# Altium project main_board.PrjPcb
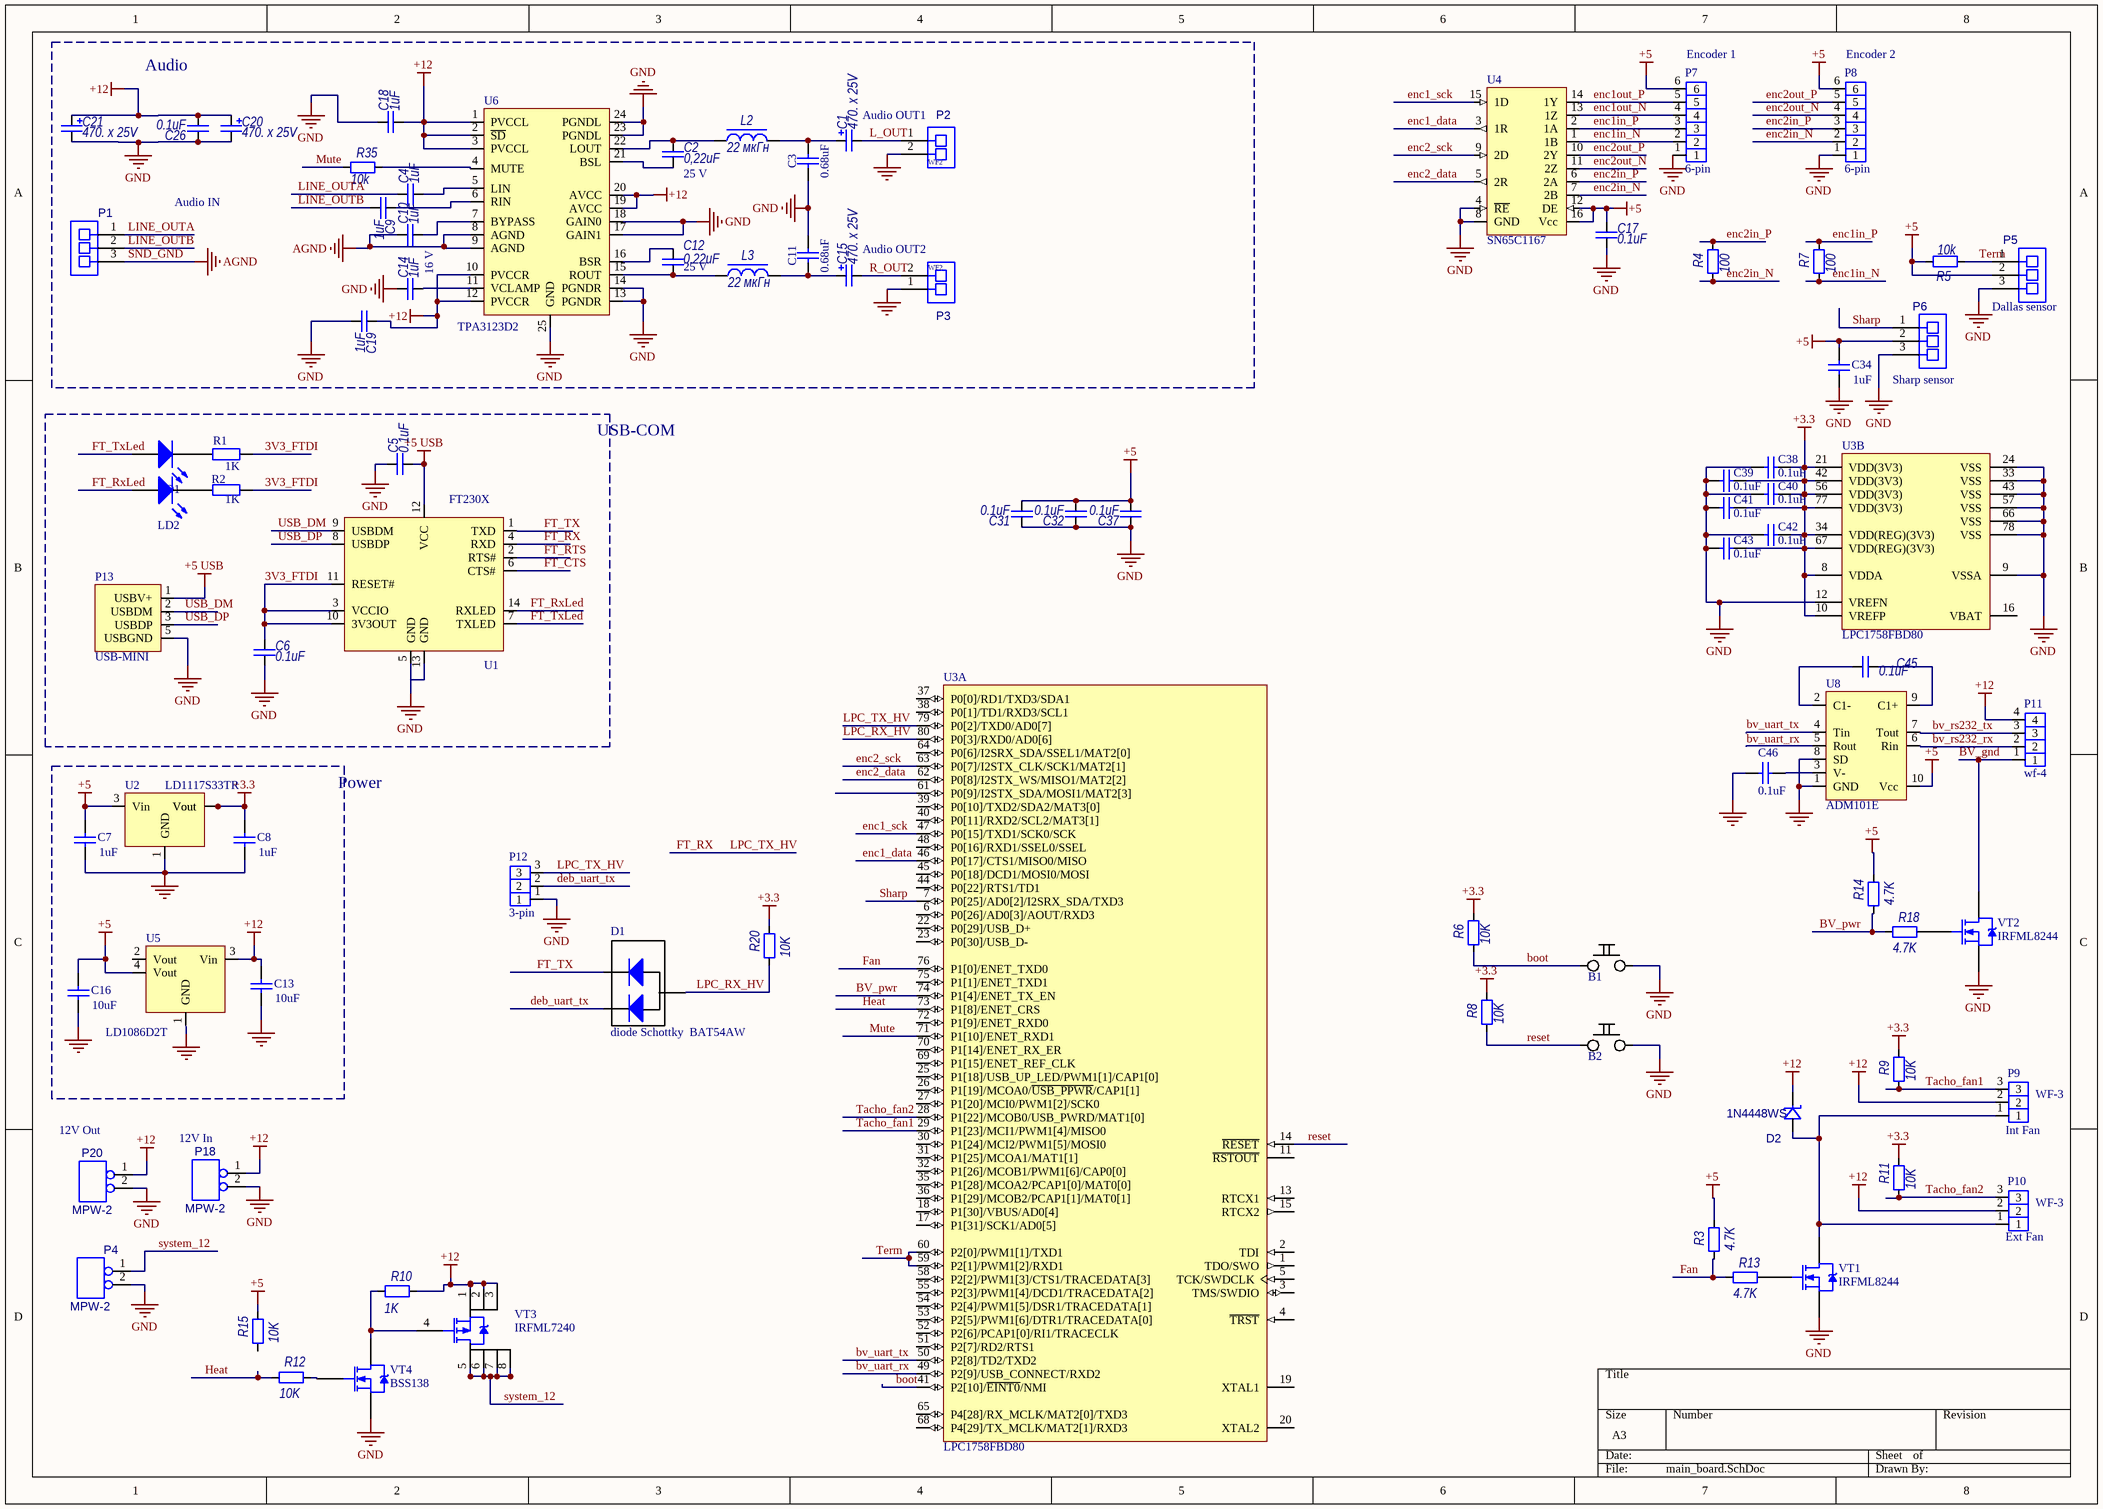
[diagram p0: main_board.SchDoc]
1 sheet, 86 parts. Net scope: global (net labels, ports and power ports of the same name join across sheets).
Board file: main_board.PcbDoc

## Sheet main_board.SchDoc
size A3

### Parts
B1  smd button  [BUTTON SMD]  (value not drawn)
B2  smd button  [BUTTON SMD]  (value not drawn)
C1  470. x 25V  [CAP+_D10_dip]
C2  0,22uF  voltage: 25 V  [CAPC1608M]
C3  0.68uF  [CAPC3216N]
C4  1uF  [CAPC1608M]
C5  0.1uF  [CAPC1608M]
C6  0.1uF  [CAPC1608M]
C7  1uF  [CAPC1608M]
C8  1uF  [CAPC1608M]
C9  1uF  [CAPC1608M]
C10  1uF  [CAPC1608M]
C11  0.68uF  [CAPC3216N]
C12  0,22uF  voltage: 25 V  [CAPC1608M]
C13  10uF  [CAPC1608M]
C14  1uF  voltage: 16 V  [CAPC1608M]
C15  470. x 25V  [CAP+_D10_dip]
C16  10uF  [CAPC1608M]
C17  0.1uF  [CAPC1608M]
C18  1uF  [CAPC1608M]
C19  1uF  [CAPC1608M]
C20  470. x 25V  [CAP+_D10_dip]
C21  470. x 25V  [CAP+_D10_dip]
C26  0.1uF  [CAPC1608M]
C31  0.1uF  [CAPC1608M]
C32  0.1uF  [CAPC1608M]
C34  1uF  [CAPC1608M]
C37  0.1uF  [CAPC1608M]
C38  0.1uF  [CAPC1608M]
C39  0.1uF  [CAPC1608M]
C40  0.1uF  [CAPC1608M]
C41  0.1uF  [CAPC1608M]
C42  0.1uF  [CAPC1608M]
C43  0.1uF  [CAPC1608M]
C45  0.1uF  [CAPC1608M]
C46  0.1uF  [CAPC1608M]
D1  diode Schottky  BAT54AW  [SOT323-3AM]
D2  1N4448WS  [CD2012-0805]
L2  22 мкГн  [SDR0805]
L3  22 мкГн  [SDR0805]
LD1  green led  [RESC2012M]  (value not drawn)
LD2  red led  [RESC2012M]  (value not drawn)
P1  WF-3  [WF-3]  (value not drawn)
P2  WF2  [wf-2]
P3  WF2  [wf-2]
P4  MPW-2  [MPW-2]
P5  WF-3  [WF-3]  (value not drawn)
P6  WF-3  [WF-3]  (value not drawn)
P7  6-pin  [wf-6]
P8  6-pin  [wf-6]
P9  WF-3  [wf-3]
P10  WF-3  [wf-3]
P11  wf-4  [wf-4]
P12  3-pin  [conn_3_2.54]
P13  USB-MINI  [USB/SM0.8-6H5 - step]
P18  MPW-2  [MPW-2]
P20  MPW-2  [MPW-2]
R1  1K  [RESC1608M]
R2  1K  [RESC1608M]
R3  4.7K  [RESC1608M]
R4  100  [RESC1608M]
R5  10k  [RESC1608M]
R6  10K  [RESC1608M]
R7  100  [RESC1608M]
R8  10K  [RESC1608M]
R9  10K  [RESC1608M]
R10  1K  [RESC1608M]
R11  10K  [RESC1608M]
R12  10K  [RESC1608M]
R13  4.7K  [RESC1608M]
R14  4.7K  [RESC1608M]
R15  10K  [RESC1608M]
R18  4.7K  [RESC1608M]
R20  10K  [RESC1608M]
R35  10k  [RESC1608M]
U1  FT230X  [SOP635P600-16N]
U2  LD1117S33TR  [SOT223-4M_2-4SC]
U3  LPC1758FBD80  [SOT315-1_V]  (parts A,B of 2)
U4  SN65C1167  [SOIC127P600-16M - increase width]
U5  LD1086D2T  [TO254P1280-3_4M]
U6  TPA3123D2
U8  ADM101E  [TSSOP50P490-10AM]
VT1  IRFML8244
VT2  IRFML8244
VT3  IRFML7240
VT4  BSS138

### Blocks framed on the sheet
Audio: C1-C4 C9-C12 C14 C15 C18-C21 C26 L2 L3 P1-P3 R35 U6
USB-COM: C5 C6 LD1 LD2 P13 R1 R2 U1
Power: C7 C8 C13 C16 U2 U5

### Nets
+3.3: C8.1 C38.2 C39.2 C40.2 C41.2 C42.2 C43.2 R6.2 R8.2 R9.2 R11.2 R20.2 U2.2(Vout) U2.4(Vout) U3.8(VDDA) U3.10(VREFP) U3.21(VDD(3V3)) U3.34(VDD(REG)(3V3)) U3.42(VDD(3V3)) U3.56(VDD(3V3)) U3.67(VDD(REG)(3V3)) U3.77(VDD(3V3))
+5: C7.1 C16.1 C17.1 C31.2 C32.2 C34.1 C37.2 P5.2 P6.2 P7.6 P8.6 R3.2 R5.2 R14.2 R15.2 U2.3(Vin) U4.12(DE) U4.16(Vcc) U5.4(Vout) U8.10(Vcc)
+5 USB: C5.2 P13.1(USBV+) U1.12(VCC)
+12: C13.1 C18.2 C19.1 C20.1 C21.1 C26.2 D2.2 P9.2 P10.2 P11.4 P18.1 P20.1 R10.2 U5.3(Vin) U6.1(PVCCL) U6.2(~{SD}) U6.3(PVCCL) U6.10(PVCCR) U6.12(PVCCR) U6.19(AVCC) U6.20(AVCC) VT3.1(S) VT3.2(S) VT3.3(S)
GND: B1.2 B2.2 C3.1 C5.1 C6.2 C7.2 C8.2 C11.2 C13.2 C14.1 C16.2 C17.2 C18.1 C19.2 C20.2 C21.2 C26.1 C31.1 C32.1 C34.2 C37.1 C38.1 C39.1 C40.1 C41.1 C42.1 C43.1 C46.2 P2.2 P3.1 P4.2 P5.3 P6.3 P7.1 P8.1 P12.1 P13.5(USBGND) P18.2 P20.2 U1.5(GND) U1.13(GND) U2.1(GND) U3.9(VSSA) U3.12(VREFN) U3.24(VSS) U3.33(VSS) U3.43(VSS) U3.57(VSS) U3.66(VSS) U3.78(VSS) U4.4(~{RE}) U4.8(GND) U5.1(GND) U6.13(PGNDR) U6.14(PGNDR) U6.17(GAIN1) U6.18(GAIN0) U6.23(PGNDL) U6.24(PGNDL) U6.25(GND) U8.1(GND) U8.8(SD) VT1.2(S) VT2.2(S) VT4.2(S)
SND_GND: C10.1 P1.3 U6.8(AGND) U6.9(AGND)  [also labelled AGND]
3V3_FTDI: C6.1 R1.1 R2.1 U1.3(VCCIO) U1.10(3V3OUT) U1.11(RESET#)
boot: B1.1 R6.1 U3.41(P2[10]/~{EINT0}/NMI)
BV_gnd: P11.1 VT2.3(D)
BV_pwr: R14.1 R18.1 U3.74(P1[4]/ENET_TX_EN)
bv_rs232_rx: P11.2 U8.6(Rin)
bv_rs232_tx: P11.3 U8.7(Tout)
bv_uart_rx: U3.49(P2[9]/USB_CONNECT/RXD2) U8.5(Rout)
bv_uart_tx: U3.50(P2[8]/TD2/TXD2) U8.4(Tin)
deb_uart_tx: D1.2(A) P12.2
enc1_data: U3.46(P0[17]/CTS1/MISO0/MISO) U4.3(1R)
enc1_sck: U3.47(P0[15]/TXD1/SCK0/SCK) U4.15(1D)
enc1in_N: P7.2 R7.1 U4.1(1B)
enc1in_P: P7.3 R7.2 U4.2(1A)
enc1out_N: P7.4 U4.13(1Z)
enc1out_P: P7.5 U4.14(1Y)
enc2_data: U3.62(P0[8]/I2STX_WS/MISO1/MAT2[2]) U4.5(2R)
enc2_sck: U3.63(P0[7]/I2STX_CLK/SCK1/MAT2[1]) U4.9(2D)
enc2in_N: P8.2 R4.1 U4.7(2B)
enc2in_P: P8.3 R4.2 U4.6(2A)
enc2out_N: P8.4 U4.11(2Z)
enc2out_P: P8.5 U4.10(2Y)
Fan: R3.1 R13.1 U3.76(P1[0]/ENET_TXD0)
FT_CTS: U1.6(CTS#)
FT_RTS: U1.2(RTS#)
FT_RX: P12.3 U1.4(RXD) U3.79(P0[2]/TXD0/AD0[7])  [also labelled LPC_TX_HV]
FT_RxLed: LD2.1(A) U1.14(RXLED)
FT_TX: D1.1(A) U1.1(TXD)
FT_TxLed: LD1.1(A) U1.7(TXLED)
Heat: R12.1 U3.73(P1[8]/ENET_CRS)
L_OUT: C1.2 P2.1
LINE_OUTA: C4.1 P1.1
LINE_OUTB: C9.2 P1.2
LPC_RX_HV: D1.3(K) R20.1 U3.80(P0[3]/RXD0/AD0[6])
Mute: R35.1 U3.71(P1[10]/ENET_RXD1)
R_OUT: C15.2 P3.2
reset: B2.1 R8.1 U3.14(~{RESET})
Sharp: P6.1 U3.7(P0[25]/AD0[2]/I2SRX_SDA/TXD3)
system_12: P4.1 VT3.5(D) VT3.6(D) VT3.7(D) VT3.8(D)
Tacho_fan1: P9.3 R9.1 U3.29(P1[23]/MCI1/PWM1[4]/MISO0)
Tacho_fan2: P10.3 R11.1 U3.28(P1[22]/MCOB0/USB_PWRD/MAT1[0])
Term: P5.1 R5.1 U3.59(P2[1]/PWM1[2]/RXD1) U3.60(P2[0]/PWM1[1]/TXD1)
USB_DM: P13.2(USBDM) U1.9(USBDM)
USB_DP: P13.3(USBDP) U1.8(USBDP)
NetC1_1: C1.1 C3.2 L2.2
NetC2_1: C2.1 L2.1 U6.22(LOUT)
NetC2_2: C2.2 U6.21(BSL)
NetC4_2: C4.2 U6.5(LIN)
NetC9_1: C9.1 U6.6(RIN)
NetC10_2: C10.2 U6.7(BYPASS)
NetC11_1: C11.1 C15.1 L3.2
NetC12_1: C12.1 U6.16(BSR)
NetC12_2: C12.2 L3.1 U6.15(ROUT)
NetC14_2: C14.2 U6.11(VCLAMP)
NetC45_1: C45.1 U8.9(C1+)
NetC45_2: C45.2 U8.2(C1-)
NetC46_1: C46.1 U8.3(V-)
NetD2_1: D2.1 P9.1 P10.1 VT1.3(D)
NetLD1_2: LD1.2(K) R1.2
NetLD2_2: LD2.2(K) R2.2
NetR10_1: R10.1 VT3.4(G) VT4.3(D)
NetR12_2: R12.2 VT4.1(G)
NetR13_2: R13.2 VT1.1(G)
NetR18_2: R18.2 VT2.1(G)
NetR35_2: R35.2 U6.4(MUTE)

Not connected (* = marked no-connect by the designer): R15 1; U1 15(CBUS0) 16(CBUS3); U3 1(TDO/SWO) 2(TDI) 3(TMS/SWDIO) 4(~{TRST}) 5(TCK/SWDCLK) 6(P0[26]/AD0[3]/AOUT/RXD3) 11(~{RSTOUT}) 13(RTCX1) 15(RTCX2) 16(VBAT) 17(P1[31]/SCK1/AD0[5]) 18(P1[30]/VBUS/AD0[4]) 19(XTAL1) 20(XTAL2) 22(P0[29]/USB_D+) 23(P0[30]/USB_D-) 25(P1[18]/USB_UP_LED/PWM1[1]/CAP1[0]) 26(P1[19]/MCOA0/~{USB_PPWR}/CAP1[1]) 27(P1[20]/MCI0/PWM1[2]/SCK0) 30(P1[24]/MCI2/PWM1[5]/MOSI0) 31(P1[25]/MCOA1/MAT1[1]) 32(P1[26]/MCOB1/PWM1[6]/CAP0[0]) 35(P1[28]/MCOA2/PCAP1[0]/MAT0[0]) 36(P1[29]/MCOB2/PCAP1[1]/MAT0[1]) 37(P0[0]/RD1/TXD3/SDA1) 38(P0[1]/TD1/RXD3/SCL1) 39(P0[10]/TXD2/SDA2/MAT3[0]) 40(P0[11]/RXD2/SCL2/MAT3[1]) 44(P0[22]/RTS1/TD1) 45(P0[18]/DCD1/MOSI0/MOSI) 48(P0[16]/RXD1/SSEL0/SSEL) 51(P2[7]/RD2/RTS1) 52(P2[6]/PCAP1[0]/RI1/TRACECLK) 53(P2[5]/PWM1[6]/DTR1/TRACEDATA[0]) 54(P2[4]/PWM1[5]/DSR1/TRACEDATA[1]) 55(P2[3]/PWM1[4]/DCD1/TRACEDATA[2]) 58(P2[2]/PWM1[3]/CTS1/TRACEDATA[3]) 61(P0[9]/I2STX_SDA/MOSI1/MAT2[3]) 64(P0[6]/I2SRX_SDA/SSEL1/MAT2[0]) 65(P4[28]/RX_MCLK/MAT2[0]/TXD3) 68(P4[29]/TX_MCLK/MAT2[1]/RXD3) 69(P1[15]/ENET_REF_CLK) 70(P1[14]/ENET_RX_ER) 72(P1[9]/ENET_RXD0) 75(P1[1]/ENET_TXD1); U5 2(Vout)

### Notes on the sheet
- (near P7) Encoder 1
- (near P8) Encoder 2
- Audio OUT1
- (near P1) Audio IN
- Audio OUT2
- (near P5) Dallas sensor
- (near P6) Sharp sensor
- (near P20) 12V Out
- (near P18) 12V In
- (near P9) Int Fan
- (near P10) Ext Fan

### Library data of the parts
B1 = chip button: boot; Type: Кнопка
B2 = chip button: reset; Type: Кнопка
C1 C15 C20 C21 = Cap+: Tantalum and aluminium electrolytic capacitors; Type: Конденсатор; ValueSCH: 470. x 25V
C2 C4-C6 C9 C10 C12 C14 C17-C19 C26 C31 C32 C37 C45 = Cap: Ceramic capacitors; Type: Конденсатор; ValueBOM: *; MarkPCB: *
  C2 C12: ValueSCH: 0,22uF
  C4 C9 C10 C14 C18 C19: ValueSCH: 1uF
  C5 C6 C17 C26 C31 C32 C37 C45: ValueSCH: 0.1uF
C3 C11 = CPER_10NF_400V_10%_500-300X720X650: Non-polarised capacitor; Part Description: Metallized Polyester Film Capacitor (MKT); Manufacturer: EPCOS; Manufacturer Part Number: B32529C6103K000; Voltage: 400VDC/200VAC; Tolerance: ±10%; Table: Capacitors THD; Type: Конденсатор; Part Number: CPER_10NF_400V_10%_500-300X720X650; Component Kind: Standard; Component Type: Standard; Footprint: CAPR500-300X720X650; Pin Count: 2; ValueSCH: 0.68uF; Status: None; Case: LS5 W3 x L7.2 x H6.5; Mounted: Yes; Socket: No; SMD: No; ComponentHeight: 6.5mm; HelpURL: \\cern.ch\dfs\Applications\Altium\Datasheets\CPER_EPCOS_B32529.pdf; Author: CERN DEM JLC; CreateDate: 23.03.2009; LatestRevisionDate: 23.03.2009
C7 C8 C13 C16 C34 C38-C43 C46 = Cap: Capacitor; Type: Конденсатор; Published: 8-Jun-2000; LatestRevisionDate: 17-Jul-2002; LatestRevisionNote: Re-released for DXP Platform.; PackageReference: RAD-0.3; Publisher: Altium Limited; PackageDescription: Radial Cap, Thru-Hole; 2 Leads; 0.3 in Pin Spacing
  C7 C8 C34: ValueSCH: 1uF
  C13 C16: ValueSCH: 10uF
  C38-C43 C46: ValueSCH: 0.1uF
D1 = diode Schottky  BAT54AW: Schottky BAT54AW; Type: Диод
D2 = MBRS360T3: Type: Диод; Value: *
L2 L3 = Ind: Coils; Type: Индуктивность; ValueSCH: 22 мкГн
LD1 = chip led
LD2 = chip led: Type: Резистор
P9 P10 = 3-pin: Type: Разъём
P11 = 4-pin: Type: Разъём
R1 R2 = Res2: Resistor; Published: 8-Jun-2000; LatestRevisionDate: 17-Jul-2002; LatestRevisionNote: Re-released for DXP Platform.; PackageReference: AXIAL-0.4; Publisher: Altium Limited; PackageDescription: Axial Device, Thru-Hole; 2 Leads; 0.4 in Pin Spacing; ValueSCH: 1K; Type: Резистор
R3-R15 R18 R20 R35 = Res: Ceramic resisors; ValueBOM: *; MarkPCB: *; Type: Резистор
  R3 R13 R14 R18: ValueSCH: 4.7K
  R4 R7: ValueSCH: 100
  R5 R35: ValueSCH: 10k
  R6 R8 R9 R11 R12 R15 R20: ValueSCH: 10K
  R10: ValueSCH: 1K
U2 = LD1117: Type: Микросхема
U3 = LPC1758FBD80: 32-bit ARM Cortex-M3 MCU, 512 kB Flash, 64 kB SRAM, 100 MHz, USB 2.0 Device/Host/OTG, Ethernet, CAN, 12-Bit ADC, DAC, I2S, 80-Pin LQFP; fmax: 100 MHz; SRAM: 64 kB; Flash: 512 kB; GPIOs: 52; USB: 1; CAN: 2; UART: 4; PWM: 6; PLL: Y; VDD (min): 2.4 V; VDD (typ): 3.3 V; VDD (max): 3.6 V; Code_IEC: 136E15; DatasheetVersion: Rev. 7, Mar-2011; PackageVersion: Feb-2003; PackageReference: SOT315-1; PackageDescription: LQFP80: Plastic Low Profile Quad Flat Package; 80 Leads; Body 12 x 12 x 1.4 mm; SPI: 1; SSP: 2; ADC channels: 6; Timers: 4; Code_JEDEC: MS-026; PartNumber: LPC1758FBD80; ComponentLink1Description: Manufacturer URL; ComponentLink1URL: http://www.nxp.com/; ComponentLink2Description: Datasheet; ComponentLink2URL: http://www.nxp.com/documents/data_sheet/LPC1759_58_56_54_52_51.pdf; Type: Микросхема
U4 = SN65C1167: RS-422 Dual Differential Drivers and Receivers; Type: Микросхема
U5 = LD1086D2T: st LD1086D2T; Type: Микросхема
U6 = TPA3123D2: 25-W STEREO CLASS-D AUDIO POWER AMPLIFIER
U8 = ADM101E: Tiny RS-232 Transceiver; PartType: Микросхема; Type: Микросхема
VT1 VT2 VT4 = IRFML8244: MOSFET N; Type: Транзистор
VT3 = IRFML7240: MOSFET P; Type: Транзистор
P1 P5 P6 = WF-3: Value: *; Type: Разъём
P2 P3 = WF2: Value: *; Type: Разъём
P4 P18 P20 = MPW-2: Value: *; Type: Разъём
P7 P8 = 6-pin: Type: Разъём
P12 = 3-pin: Type: Разъём
P13 = USB-MINI: Type: Разъём
U1 = FT230X: Type: Микросхема